# EAGLE schematic test1 (EAGLE 4.13)
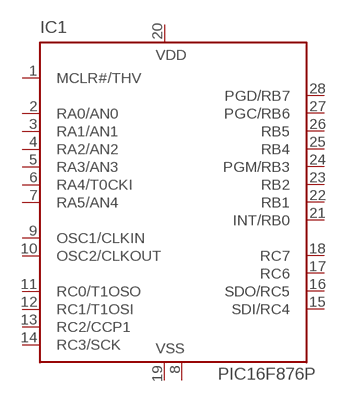
[diagram p0: schematic, sheet 1]

## Parts
IC1  PIC16F876P  [DIL28-6]
Unconnected: IC1.1(MCLR#/THV) IC1.2(RA0/AN0) IC1.3(RA1/AN1) IC1.4(RA2/AN2) IC1.5(RA3/AN3) IC1.6(RA4/T0CKI) IC1.7(RA5/AN4) IC1.9(OSC1/CLKIN) IC1.10(OSC2/CLKOUT) IC1.11(RC0/T1OSO) IC1.12(RC1/T1OSI) IC1.13(RC2/CCP1) IC1.14(RC3/SCK) IC1.15(SDI/RC4) IC1.16(SDO/RC5) IC1.17(RC6) IC1.18(RC7) IC1.21(INT/RB0) IC1.22(RB1) IC1.23(RB2) IC1.24(PGM/RB3) IC1.25(RB4) IC1.26(RB5) IC1.27(PGC/RB6) IC1.28(PGD/RB7)

## Power pins joined to a net without a drawn wire
VDD: IC1.20(VDD)
VSS: IC1.8(VSS) IC1.19(VSS)

## Library data of the parts
IC1 = microchip-4:PIC16*876: MICROCONTROLLER flash type